# EAGLE schematic Roomba (EAGLE 9.6.2)
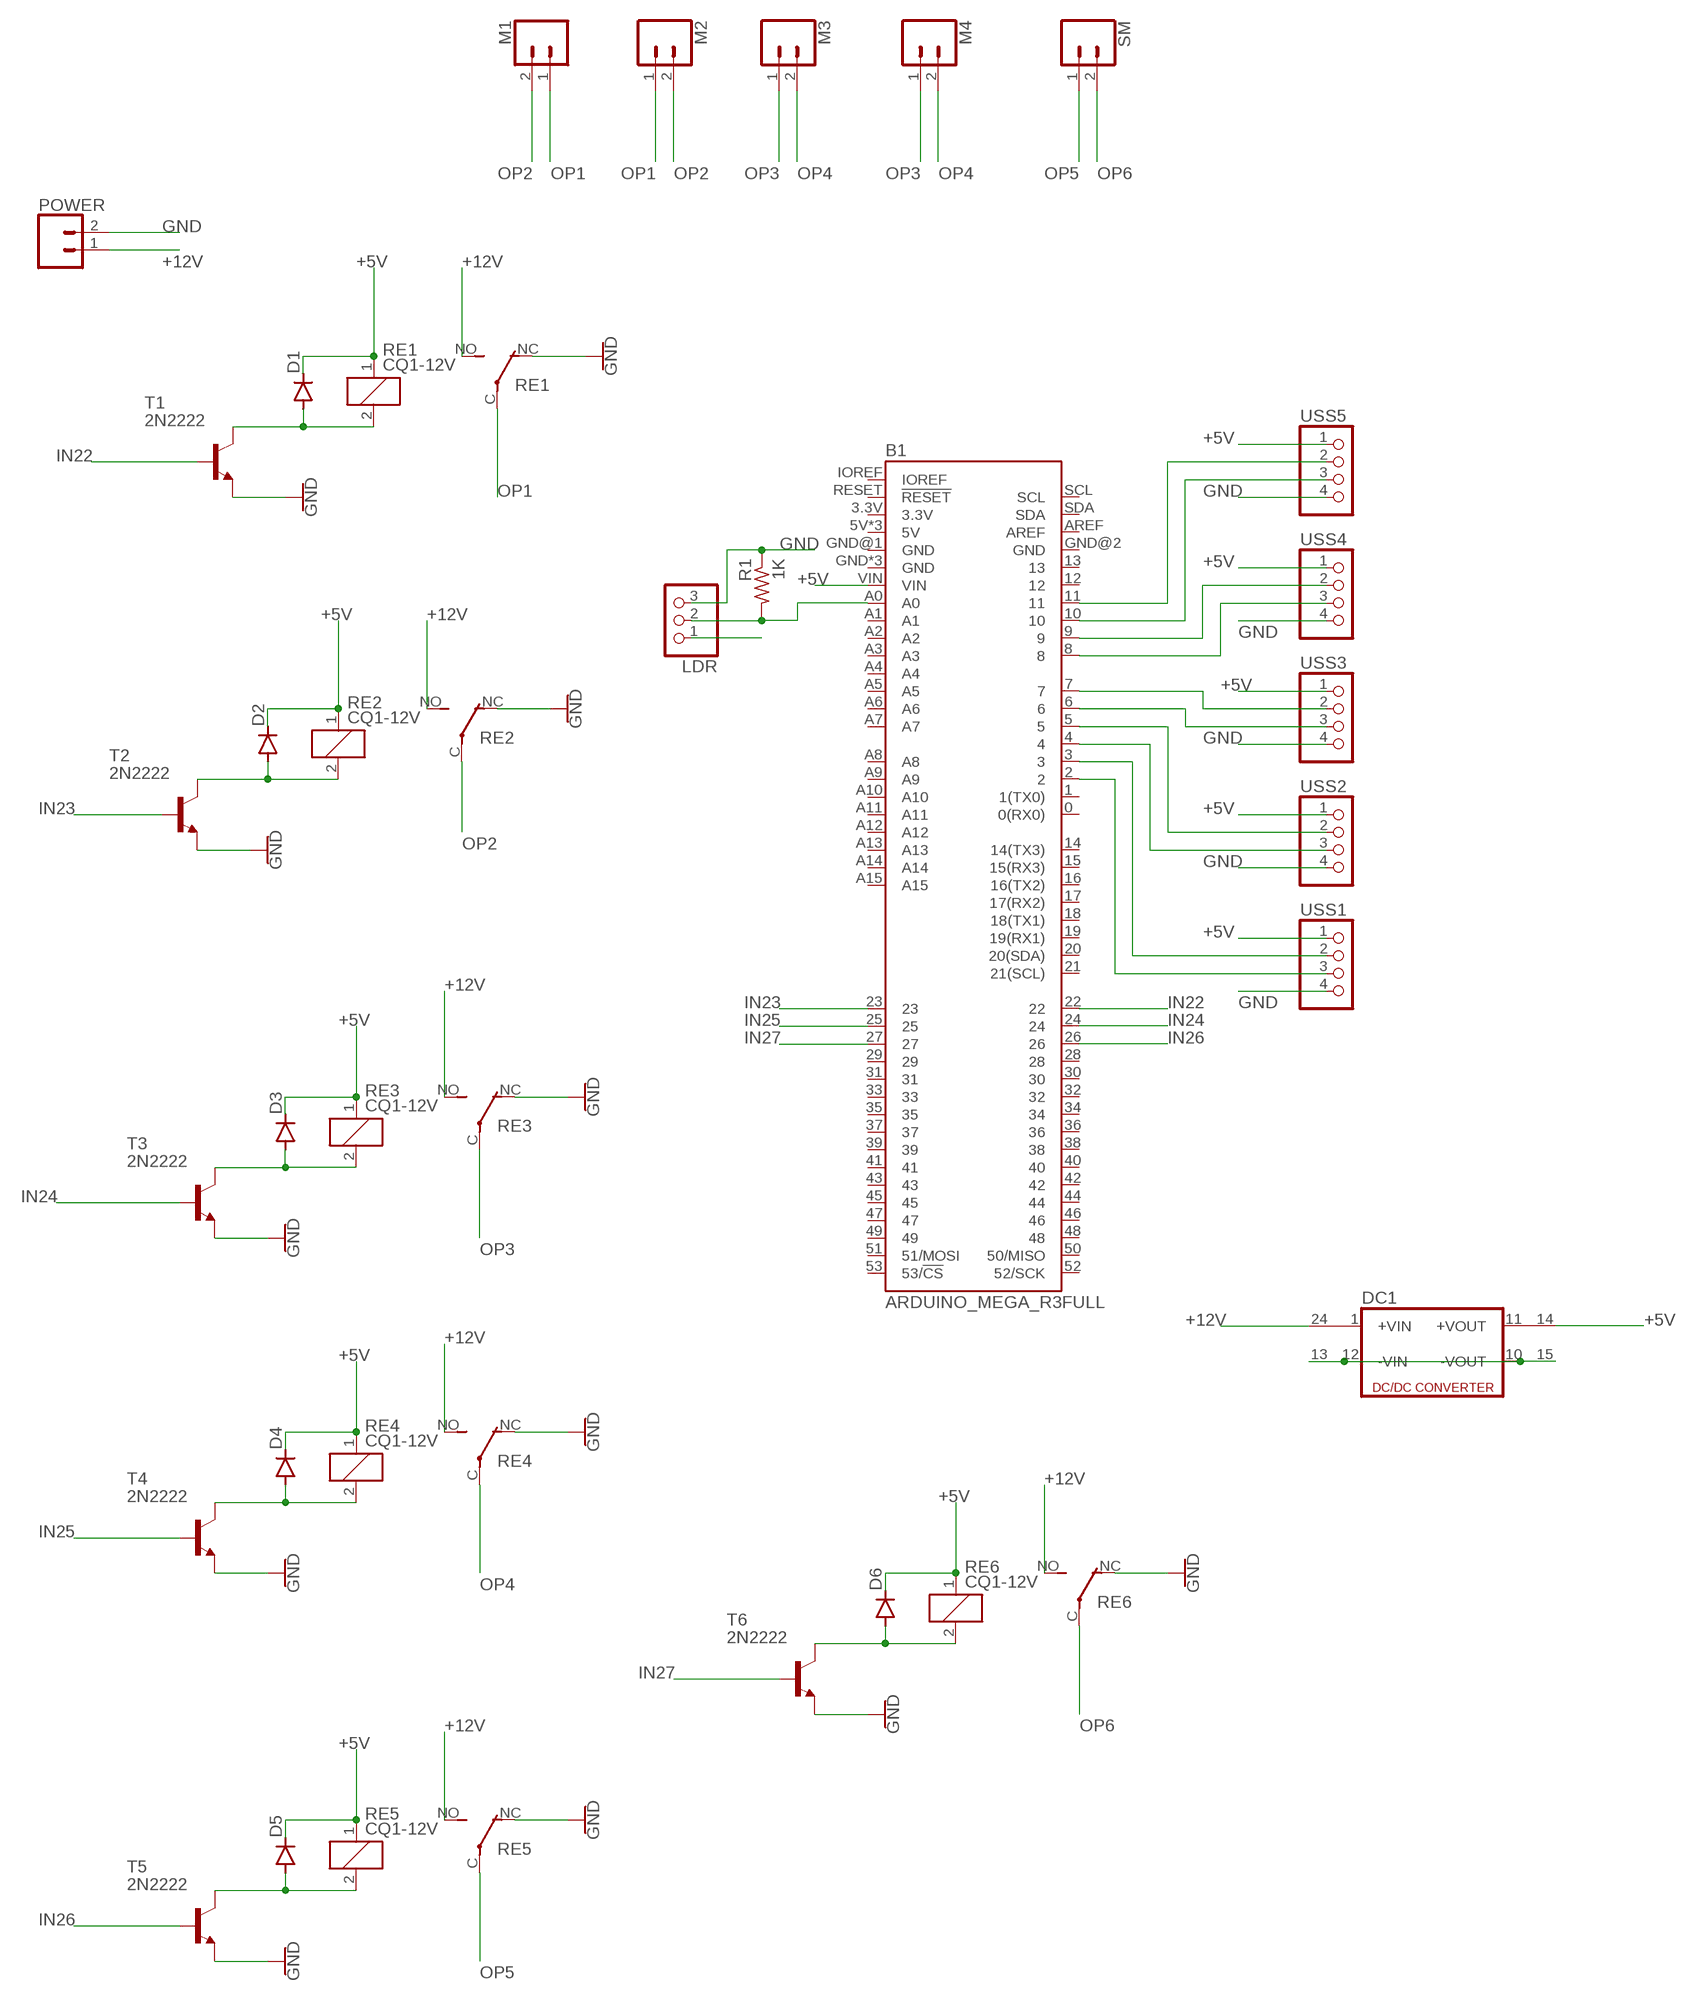
[diagram p0: schematic, sheet 1]

## Parts
B1  ARDUINO_MEGA_R3FULL  [ARDUINO_MEGA_NO_SILK]
D1  1N4148DO35-7  [DO35-7]
D2  1N4148DO35-7  [DO35-7]
D3  1N4148DO35-7  [DO35-7]
D4  1N4148DO35-7  [DO35-7]
D5  1N4148DO35-7  [DO35-7]
D6  1N4148DO35-7  [DO35-7]
DC1  DC213R  [CMK]
LDR  PINHD-1X3  [1X03]
M1  CONN_02  [1X02]
M2  CONN_02  [1X02]
M3  CONN_02  [1X02]
M4  CONN_02  [1X02]
POWER  CONN_02  [1X02]
R1  1K  R-US_0204/7  [0204/7]
RE1  CQ1-12V  [CQ1]
RE2  CQ1-12V  [CQ1]
RE3  CQ1-12V  [CQ1]
RE4  CQ1-12V  [CQ1]
RE5  CQ1-12V  [CQ1]
RE6  CQ1-12V  [CQ1]
SM  CONN_02  [1X02]
T1  2N2222  [TO92-EBC-OVAL]
T2  2N2222  [TO92-EBC-OVAL]
T3  2N2222  [TO92-EBC-OVAL]
T4  2N2222  [TO92-EBC-OVAL]
T5  2N2222  [TO92-EBC-OVAL]
T6  2N2222  [TO92-EBC-OVAL]
USS1  PINHD-1X4  [1X04]
USS2  PINHD-1X4  [1X04]
USS3  PINHD-1X4  [1X04]
USS4  PINHD-1X4  [1X04]
USS5  PINHD-1X4  [1X04]

## Nets
+5V: B1.VIN D1.C D2.C D3.C D4.C D5.C D6.C DC1.14(+VOUT1) RE1.1 RE2.1 RE3.1 RE4.1 RE5.1 RE6.1 USS1.1 USS2.1 USS3.1 USS4.1 USS5.1
+12V: DC1.24(+VIN1) POWER.1 RE1.NO(2:S) RE2.NO(2:S) RE3.NO(2:S) RE4.NO(2:S) RE5.NO(2:S) RE6.NO(2:S)
GND: LDR.3 POWER.2 R1.1 RE1.NC(2:O) RE2.NC(2:O) RE3.NC(2:O) RE4.NC(2:O) RE5.NC(2:O) RE6.NC(2:O) T1.E T2.E T3.E T4.E T5.E T6.E USS1.4 USS2.4 USS3.4 USS4.4 USS5.4
IN22: B1.22 T1.B
IN23: B1.23 T2.B
IN24: B1.24 T3.B
IN25: B1.25 T4.B
IN26: B1.26 T5.B
IN27: B1.27 T6.B
N$1: B1.2 USS1.3
N$2: B1.3 USS1.2
N$3: B1.4 USS2.3
N$4: B1.5 USS2.2
N$5: B1.6 USS3.3
N$6: B1.7 USS3.2
N$11: B1.8 USS4.3
N$12: B1.9 USS4.2
N$13: B1.10 USS5.3
N$14: B1.11 USS5.2
N$24: DC1.10(-VOUT) DC1.12(-VIN) DC1.13(-VIN1) DC1.15(-VOUT1)
N$29: D1.A RE1.2 T1.C
N$31: D2.A RE2.2 T2.C
N$32: D3.A RE3.2 T3.C
N$33: D6.A RE6.2 T6.C
N$34: D4.A RE4.2 T4.C
N$42: D5.A RE5.2 T5.C
N$46: B1.A0 LDR.2 R1.2
N$48: LDR.1
OP1: M1.1 M2.1 RE1.C(2:P)
OP2: M1.2 M2.2 RE2.C(2:P)
OP3: M3.1 M4.1 RE3.C(2:P)
OP4: M3.2 M4.2 RE4.C(2:P)
OP5: RE5.C(2:P) SM.1
OP6: RE6.C(2:P) SM.2
Unconnected: B1.0(0(RX0)) B1.1(1(TX0)) B1.3.3V B1.5V B1.5V@1(5V) B1.5V@2(5V) B1.12 B1.13 B1.14(14(TX3)) B1.15(15(RX3)) B1.16(16(TX2)) B1.17(17(RX2)) B1.18(18(TX1)) B1.19(19(RX1)) B1.20(20(SDA)) B1.21(21(SCL)) B1.28 B1.29 B1.30 B1.31 B1.32 B1.33 B1.34 B1.35 B1.36 B1.37 B1.38 B1.39 B1.40 B1.41 B1.42 B1.43 B1.44 B1.45 B1.46 B1.47 B1.48 B1.49 B1.50(50/MISO) B1.51(51/MOSI) B1.52(52/SCK) B1.53(53/!CS) B1.A1 B1.A2 B1.A3 B1.A4 B1.A5 B1.A6 B1.A7 B1.A8 B1.A9 B1.A10 B1.A11 B1.A12 B1.A13 B1.A14 B1.A15 B1.AREF B1.GND B1.GND@1(GND) B1.GND@2(GND) B1.GND@3(GND) B1.GND@4(GND) B1.IOREF B1.RESET(!RESET) B1.SCL B1.SDA DC1.1(+VIN) DC1.11(+VOUT)

## Library data of the parts
B1 = SparkFun-Boards:ARDUINO_MEGA_R3: Arduino Mega R3 ATmega2560 R3 compatible footprint. SparkFun Products: Arduino Mega 2560 R3 <https://www.sparkfun.com/products/11061>
D1-D6 = diode:1N4148: DIODE high speed (Philips)
DC1 = dc-dc-converter:DC213R: DC-DC CONVERTER; OC_FARNELL: unknown; OC_NEWARK: unknown
LDR = pinhead:PINHD-1X3: PIN HEADER
M1-M4 POWER SM = SparkFun-Connectors:CONN_02: Multi connection point. Often used as Generic Header-pin footprint for 0.1 inch spaced/style header connections On any of the 0.1 inch spaced packages, you can populate with these: Break Away Headers - Straight <https://www.sparkfun.com/products/116> (PRT-00116) Break Away Male Headers - Right Angle <https://www.sparkfun.com/products/553> (PRT-00553) Female Headers <https://www.sparkfun.com/products/115> (PRT-00115) Break Away Headers - Machine Pin <https://www.sparkfun.com/products/117> (PRT-00117) Break Away Female Headers - Swiss Machine Pin <https://www.sparkfun.com/products/743> (PRT-00743) For SCREWTERMINALS and SPRING TERMINALS visit here: Screw Terimnals on SparkFun.com <https://www.sparkfun.com/search/results?term=Screw+Terminals> (5mm/3.5mm/2.54mm spacing) This device is also useful as a general connection point to wire up your design to another part of your project. Our various solder wires solder well into these plated through hole pads. Hook-Up Wire - Assortment (Stranded, 22 AWG) <https://www.sparkfun.com/products/11375> (PRT-11375) Hook-Up Wire - Assortment (Solid Core, 22 AWG) <https://www.sparkfun.com/products/11367> (PRT-11367) View the entire wire category on our website here <https://www.sparkfun.com/categories/141> Special notes: Molex polarized connector foot print use with: PRT-08233 with associated crimp pins and housings. 2.54_SCREWTERM for use with PRT-10571. 3.5mm Screw Terminal footprints for PRT-08084 5mm Screw Terminal footprints for use with PRT-08432
R1 = rcl:R-US_: RESISTOR, American symbol; SPICEPREFIX: R
RE1-RE6 = relay:CQ1-12V: AUTOMOTIVE QUIET RELAY NAiS Source: http://www.mew-europe.com/.. en_ds_61208_0000.pdf; OC_FARNELL: unknown; OC_NEWARK: unknown
T1-T6 = adafruit:2N2222: NPN TRANSISTOR Big oval pads
USS1-USS5 = pinhead:PINHD-1X4: PIN HEADER